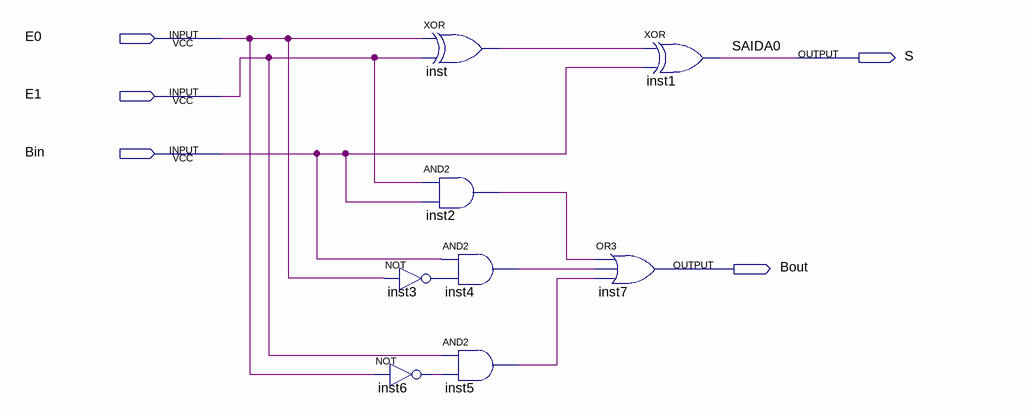
[diagram p0: schematic sheet]
// Quartus schematic FULLSUBTRACTOR.bdf as structural Verilog: 8 symbols, 5 pins
module FULLSUBTRACTOR (
  input  E0,
  input  E1,
  input  Bin,
  output S,
  output Bout
);

  wire inst2_out, inst3_out, inst4_out, inst5_out, inst6_out, inst_out;

  not inst3 (inst3_out, E0);
  not inst6 (inst6_out, E0);
  xor inst (inst_out, E0, E1);
  and inst2 (inst2_out, E1, Bin);
  and inst4 (inst4_out, Bin, inst3_out);
  and inst5 (inst5_out, E1, inst6_out);
  or inst7 (Bout, inst2_out, inst4_out, inst5_out);
  xor inst1 (S, inst_out, Bin);

  // Other names for the same wires on the sheet: SAIDA0 = S
endmodule
